# Altium schematic sheet microInv_batt_controller.SchDoc
size A3; SheetNumber: 1; SheetTotal: 1
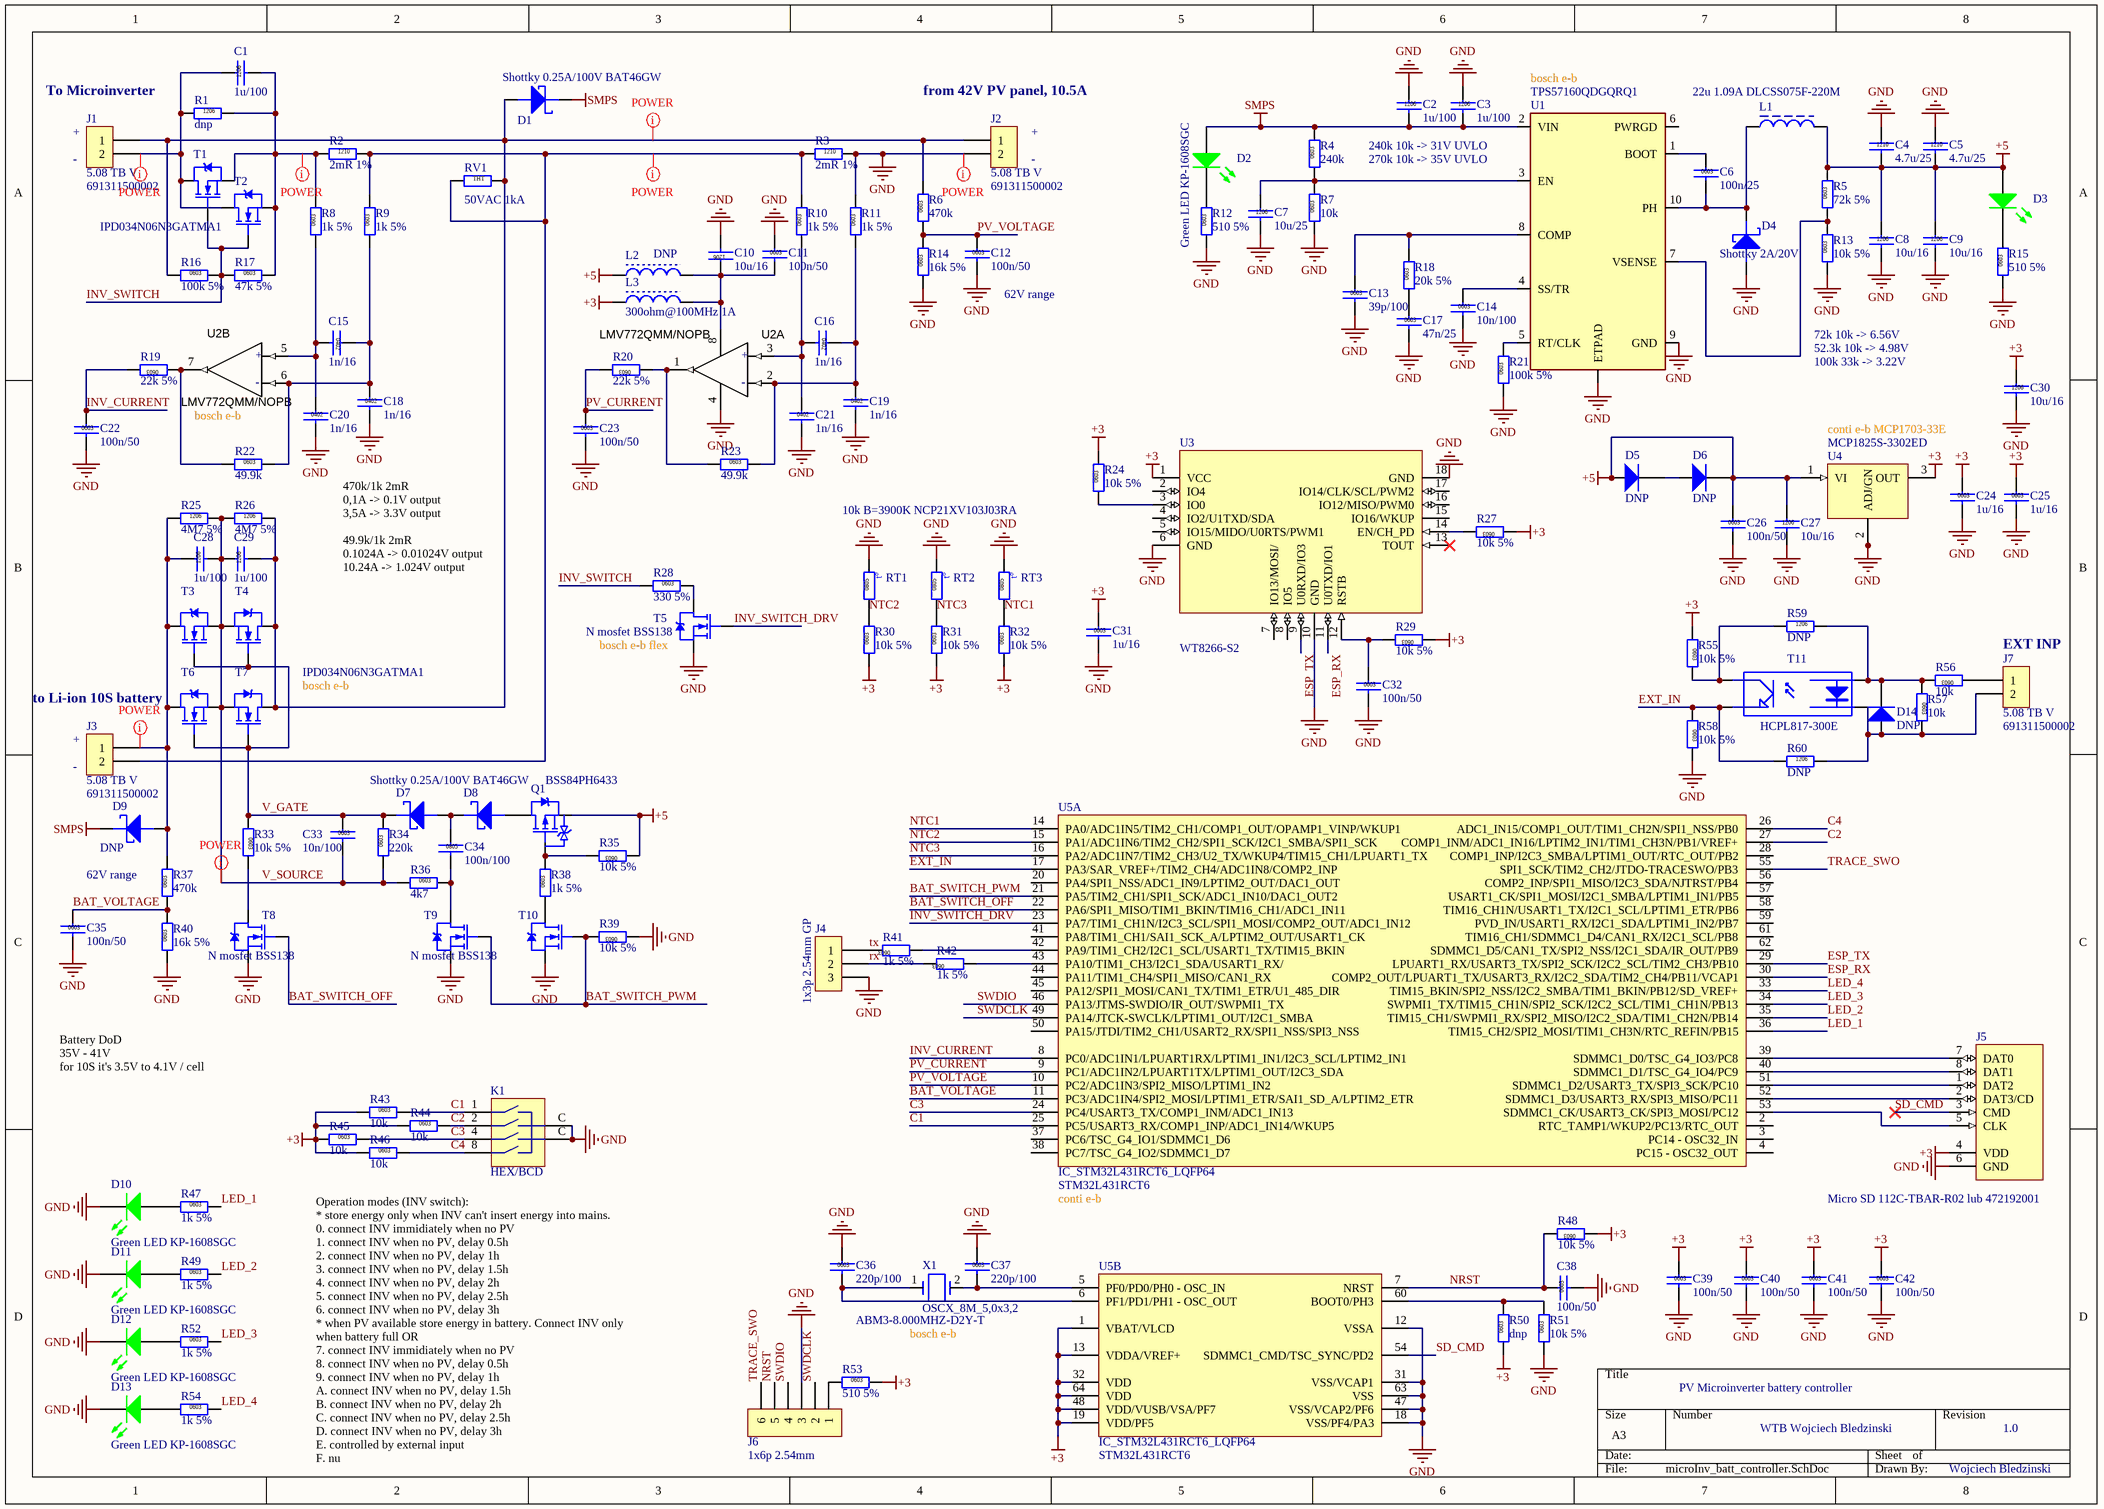
[diagram p0: microInv_batt_controller.SchDoc]

## Parts
C1  1u/100  [CAP_1206]
C2  1u/100  [CAP_1206]
C3  1u/100  [CAP_1206]
C4  4.7u/25  [CAP_1210]
C5  4.7u/25  [CAP_1210]
C6  100n/25  [CAP_0603]
C7  10u/25  [CAP_1206]
C8  10u/16  [CAP_1206]
C9  10u/16  [CAP_1206]
C10  10u/16  [CAP_1206]
C11  100n/50  [CAP_0603]
C12  100n/50  [CAP_0603]
C13  39p/100  [CAP_0603]
C14  10n/100  [CAP_0603]
C15  1n/16  [CAP_0402_HD_IPC]
C16  1n/16  [CAP_0402_HD_IPC]
C17  47n/25  [CAP_0603]
C18  1n/16  [CAP_0402_HD_IPC]
C19  1n/16  [CAP_0402_HD_IPC]
C20  1n/16  [CAP_0402_HD_IPC]
C21  1n/16  [CAP_0402_HD_IPC]
C22  100n/50  [CAP_0603]
C23  100n/50  [CAP_0603]
C24  1u/16  [CAP_0603]
C25  1u/16  [CAP_0603]
C26  100n/50  [CAP_0603]
C27  10u/16  [CAP_1206]
C28  1u/100  [CAP_1206]
C29  1u/100  [CAP_1206]
C30  10u/16  [CAP_1206]
C31  1u/16  [CAP_0603]
C32  100n/50  [CAP_0603]
C33  10n/100  [CAP_0603]
C34  100n/100  [CAP_0805]
C35  100n/50  [CAP_0603]
C36  220p/100  [CAP_0603]
C37  220p/100  [CAP_0603]
C38  100n/50  [CAP_0603]
C39  100n/50  [CAP_0603]
C40  100n/50  [CAP_0603]
C41  100n/50  [CAP_0603]
C42  100n/50  [CAP_0603]
D1  Shottky 0.25A/100V BAT46GW  [SOD_123]
D2  Green LED KP-1608SGC  [LED_0603_GREEN]
D3  Green LED KP-1608SGC  [LED_0603_GREEN]  (value not drawn)
D4  Shottky 2A/20V  [SMA_DO-214AC]
D5  DNP  [D_MINIMELF]
D6  DNP  [D_MINIMELF]
D7  Shottky 0.25A/100V BAT46GW  [SOD_123]
D8  Shottky 0.25A/100V BAT46GW  [SOD_123]  (value not drawn)
D9  DNP  [SOD_123]
D10  Green LED KP-1608SGC  [LED_0603_GREEN]
D11  Green LED KP-1608SGC  [LED_0603_GREEN]
D12  Green LED KP-1608SGC  [LED_0603_GREEN]
D13  Green LED KP-1608SGC  [LED_0603_GREEN]
D14  DNP  [D_MINIMELF]
J1  5.08 TB V  Manufacturer Part Number: 691311500002  [CON_1x2_5.08TB]
J2  5.08 TB V  Manufacturer Part Number: 691311500002  [CON_1x2_5.08TB]
J3  5.08 TB V  Manufacturer Part Number: 691311500002  [CON_1x2_5.08TB]
J4  1x3p 2.54mm GP  [CON_PIN1x3_THT]
J5  Micro SD 112C-TBAR-R02 lub 472192001  [112C_TXAR_R01]
J6  1x6p 2.54mm  [CON_PIN1x6_THT]
J7  5.08 TB V  Manufacturer Part Number: 691311500002  [CON_1x2_5.08TB]
K1  HEX/BCD  [MECH_SW_HEXBCD]
L1  22u 1.09A DLCSS075F-220M  [IND_DER0705]
L2  DNP  [RES_0603]
L3  300ohm@100MHz 1A  [RES_0603]
Q1  BSS84PH6433  [SOT23-3]
R1  dnp  [RES_1206]
R2  2mR 1%  [RES_1210]
R3  2mR 1%  [RES_1210]
R4  240k  [RES_0603]
R5  72k 5%  [RES_0603]
R6  470k  [RES_0603]
R7  10k  [RES_0603]
R8  1k 5%  [RES_0603]
R9  1k 5%  [RES_0603]
R10  1k 5%  [RES_0603]
R11  1k 5%  [RES_0603]
R12  510 5%  [RES_0603]
R13  10k 5%  [RES_0603]
R14  16k 5%  [RES_0603]
R15  510 5%  [RES_0603]
R16  100k 5%  [RES_0603]
R17  47k 5%  [RES_0603]
R18  20k 5%  [RES_0603]
R19  22k 5%  [RES_0603]
R20  22k 5%  [RES_0603]
R21  100k 5%  [RES_0603]
R22  49.9k  [RES_0603]
R23  49.9k  [RES_0603]
R24  10k 5%  [RES_0603]
R25  4M7 5%  [RES_1206]
R26  4M7 5%  [RES_1206]
R27  10k 5%  [RES_0603]
R28  330 5%  [RES_0603]
R29  10k 5%  [RES_0603]
R30  10k 5%  [RES_0603]
R31  10k 5%  [RES_0603]
R32  10k 5%  [RES_0603]
R33  10k 5%  [RES_0603]
R34  220k  [RES_0603]
R35  10k 5%  [RES_0603]
R36  4k7  [RES_0603]
R37  470k  [RES_0603]
R38  1k 5%  [RES_0603]
R39  10k 5%  [RES_0603]
R40  16k 5%  [RES_0603]
R41  1k 5%  [RES_0603]
R42  1k 5%  [RES_0603]
R43  10k  [RES_0603]
R44  10k  [RES_0603]
R45  10k  [RES_0603]
R46  10k  [RES_0603]
R47  1k 5%  [RES_0603]
R48  10k 5%  [RES_0603]
R49  1k 5%  [RES_0603]
R50  dnp  [RES_0603]
R51  10k 5%  [RES_0603]
R52  1k 5%  [RES_0603]
R53  510 5%  [RES_0603]
R54  1k 5%  [RES_0603]
R55  10k 5%  [RES_0603]
R56  10k  [RES_0603]
R57  10k  [RES_0603]
R58  10k 5%  [RES_0603]
R59  DNP  [RES_1206]
R60  DNP  [RES_1206]
RT1  10k B=3900K NCP21XV103J03RA  [RES_0805]  (value not drawn)
RT2  10k B=3900K NCP21XV103J03RA  [RES_0805]  (value not drawn)
RT3  10k B=3900K NCP21XV103J03RA  [RES_0805]
RV1  50VAC 1kA  [RES_VAR_S14]
T1  IPD034N06N3GATMA1  [DPAK_369C_issueD]
T2  IPD034N06N3GATMA1  [DPAK_369C_issueD]  (value not drawn)
T3  IPD034N06N3GATMA1  [DPAK_369C_issueD]  (value not drawn)
T4  IPD034N06N3GATMA1  [DPAK_369C_issueD]  (value not drawn)
T5  N mosfet BSS138  [SOT23-3]
T6  IPD034N06N3GATMA1  [DPAK_369C_issueD]  (value not drawn)
T7  IPD034N06N3GATMA1  [DPAK_369C_issueD]
T8  N mosfet BSS138  [SOT23-3]
T9  N mosfet BSS138  [SOT23-3]
T10  N mosfet BSS138  [SOT23-3]  (value not drawn)
T11  HCPL817-300E  [HCPL-817]
U1  TPS57160QDGQRQ1  [MSOP10_DQG_S_PDSO_G10]
U2  LMV772QMM/NOPB  [MSOP8_3x3_846AD-01]  (parts A,B of 2)
U3  WT8266-S2  [MOD_WT8266-S2]
U4  MCP1825S-3302ED  [sot223]
U5  IC_STM32L431RCT6_LQFP64  Manufacturer Part Number: STM32L431RCT6  [LQFP64_10x10]  (parts A,B of 2)
X1  OSCX_8M_5,0x3,2  Manufacturer Part Number: ABM3-8.000MHZ-D2Y-T  [X_5.0X3.2]

## Nets
+3: C24.1 C25.1 C30.1 C31.1 C39.1 C40.1 C41.1 C42.1 J5.4(VDD) L3.1 R24.2 R27.1 R29.1 R30.1 R31.1 R32.1 R43.1 R44.1 R45.1 R46.1 R48.1 R50.1 R53.2 R55.1 U3.1(VCC) U4.3(OUT) U5.1(VBAT/VLCD) U5.13(VDDA/VREF+) U5.19(VDD/PF5) U5.32(VDD) U5.48(VDD/VUSB/VSA/PF7) U5.64(VDD)
+5: C4.2 C5.2 C8.1 C9.1 C26.1 C27.1 D3.1(A) D5.1(A) D6.2(K) L1.2 L2.1 Q1.2(S) R5.2 R35.1 U4.1(VI)
GND: C2.1 C3.1 C4.1 C5.1 C7.2 C8.2 C9.2 C10.2 C11.1 C12.2 C13.2 C14.2 C17.2 C18.2 C19.2 C20.2 C21.2 C22.2 C23.2 C24.2 C25.2 C26.2 C27.2 C30.2 C31.2 C32.2 C35.2 C36.1 C37.1 C38.2 C39.2 C40.2 C41.2 C42.2 D4.1(A) D10.2(K) D11.2(K) D12.2(K) D13.2(K) J2.2 J4.3 J5.6(GND) J6.3 K1.C R3.2 R7.1 R11.2 R12.1 R13.1 R14.1 R15.1 R21.1 R39.1 R40.1 R51.1 R58.2 RT1.2 RT2.2 RT3.2 T5.2(S) T8.2(S) T9.2(S) T10.2(S) U1.9(GND) U1.11(ETPAD) U2.4(-V) U3.6(GND) U3.10(GND) U3.18(GND) U4.2(ADJ/GN) U4.4 U5.12(VSSA) U5.18(VSS/PF4/PA3) U5.31(VSS/VCAP1) U5.47(VSS/VCAP2/PF6) U5.63(VSS)
SMPS: C2.2 C3.2 D1.2(K) D2.1(A) D9.2(K) R4.2 U1.2(VIN)
BAT_SWITCH_OFF: T8.1(G) U5.22(PA6/SPI1_MISO/TIM1_BKIN/TIM16_CH1/ADC1_IN11)
BAT_SWITCH_PWM: R39.2 T9.1(G) T10.1(G) U5.21(PA5/TIM2_CH1/SPI1_SCK/ADC1_IN10/DAC1_OUT2)
BAT_VOLTAGE: C35.1 R37.1 R40.2 U5.11(PC3/ADC1IN4/SPI2_MOSI/LPTIM1_ETR/SAI1_SD_A/LPTIM2_ETR)
C1: K1.1 R43.2 U5.25(PC5/USART3_RX/COMP1_INP/ADC1_IN14/WKUP5)
C2: K1.2 R44.2 U5.27(COMP1_INM/ADC1_IN16/LPTIM2_IN1/TIM1_CH3N/PB1/VREF+)
C3: K1.4 R45.2 U5.24(PC4/USART3_TX/COMP1_INM/ADC1_IN13)
C4: K1.8 R46.2 U5.26(ADC1_IN15/COMP1_OUT/TIM1_CH2N/SPI1_NSS/PB0)
ESP_RX: U3.11(U0TXD/IO1) U5.30(COMP2_OUT/LPUART1_TX/USART3_RX/I2C2_SDA/TIM2_CH4/PB11/VCAP1)
ESP_TX: U3.9(U0RXD/IO3) U5.29(LPUART1_RX/USART3_TX/SPI2_SCK/I2C2_SCL/TIM2_CH3/PB10)
EXT_IN: R58.1 R60.1 T11.3(E) U5.17(PA3/SAR_VREF+/TIM2_CH4/ADC1IN8/COMP2_INP)
INV_CURRENT: C22.1 R19.2 U5.8(PC0/ADC1IN1/LPUART1RX/LPTIM1_IN1/I2C3_SCL/LPTIM2_IN1)
INV_SWITCH: R16.2 R17.1 R28.1 T1.1(G) T2.1(G)
INV_SWITCH_DRV: T5.1(G) U5.23(PA7/TIM1_CH1N/I2C3_SCL/SPI1_MOSI/COMP2_OUT/ADC1_IN12)
LED_1: R47.2 U5.36(TIM15_CH2/SPI2_MOSI/TIM1_CH3N/RTC_REFIN/PB15)
LED_2: R49.2 U5.35(TIM15_CH1/SWPMI1_RX/SPI2_MISO/I2C2_SDA/TIM1_CH2N/PB14)
LED_3: R52.2 U5.34(SWPMI1_TX/TIM15_CH1N/SPI2_SCK/I2C2_SCL/TIM1_CH1N/PB13)
LED_4: R54.2 U5.33(TIM15_BKIN/SPI2_NSS/I2C2_SMBA/TIM1_BKIN/PB12/SD_VREF+)
NRST: C38.1 J6.5 R48.2 U5.7(NRST)
NTC1: R32.2 RT3.1 U5.14(PA0/ADC1IN5/TIM2_CH1/COMP1_OUT/OPAMP1_VINP/WKUP1)
NTC2: R30.2 RT1.1 U5.15(PA1/ADC1IN6/TIM2_CH2/SPI1_SCK/I2C1_SMBA/SPI1_SCK)
NTC3: R31.2 RT2.1 U5.16(PA2/ADC1IN7/TIM2_CH3/U2_TX/WKUP4/TIM15_CH1/LPUART1_TX)
PV_CURRENT: C23.1 R20.2 U5.9(PC1/ADC1IN2/LPUART1TX/LPTIM1_OUT/I2C3_SDA)
PV_VOLTAGE: C12.1 R6.1 R14.2 U5.10(PC2/ADC1IN3/SPI2_MISO/LPTIM1_IN2)
rx: J4.2 R42.1
SD_CMD: J5.3(CMD) U5.54(SDMMC1_CMD/TSC_SYNC/PD2)
SWDCLK: J6.2 U5.49(PA14/JTCK-SWCLK/LPTIM1_OUT/I2C1_SMBA)
SWDIO: J6.4 U5.46(PA13/JTMS-SWDIO/IR_OUT/SWPMI1_TX)
TRACE_SWO: J6.6 U5.55(SPI1_SCK/TIM2_CH2/JTDO-TRACESWO/PB3)
tx: J4.1 R41.1
V_GATE: C33.1 D7.2(K) R33.1 R34.2 T3.1(G) T4.1(G) T6.1(G) T7.1(G)
V_SOURCE: C28.2 C29.1 C33.2 R25.2 R26.1 R34.1 R36.1 T3.3(S) T4.3(S) T6.3(S) T7.3(S)
NetC1_1: C1.1 J1.2 R1.1 T1.4(D) T2.4(D)
NetC1_2: C1.2 R1.2 R2.1 R8.2 R17.2 T1.3(S) T2.3(S)
NetC6_1: C6.1 U1.1(BOOT)
NetC6_2: C6.2 D4.2(K) L1.1 U1.10(PH)
NetC7_1: C7.1 R4.1 R7.2 U1.3(EN)
NetC10_1: C10.1 C11.2 L2.2 L3.2 U2.8(+V)
NetC13_1: C13.1 R18.2 U1.8(COMP)
NetC14_1: C14.1 U1.4(SS/TR)
NetC15_1: C15.1 C18.1 R9.1 R22.2 U2.6(-)
NetC15_2: C15.2 C20.1 R8.1 U2.5(+)
NetC16_1: C16.1 C19.1 R11.1 R23.2 U2.2(-)
NetC16_2: C16.2 C21.1 R10.1 U2.3(+)
NetC17_1: C17.1 R18.1
NetC28_1: C28.1 D9.1(A) J3.1 R25.1 R37.2 T3.4(D) T6.4(D)
NetC29_2: C29.2 D1.1(A) J1.1 J2.1 R6.2 R16.1 R26.2 RV1.2 T4.4(D) T7.4(D)
NetC32_1: C32.1 R29.2 U3.12(RSTB)
NetC34_1: C34.1 D7.1(A) D8.2(K)
NetC34_2: C34.2 R36.2 T9.3(D)
NetC36_2: C36.2 U5.6(PF1/PD1/PH1_-_OSC_OUT) X1.1
NetC37_2: C37.2 U5.5(PF0/PD0/PH0_-_OSC_IN) X1.2
NetD2_2: D2.2(K) R12.2
NetD3_2: D3.2(K) R15.2
NetD5_2: D5.2(K) D6.1(A)
NetD8_1: D8.1(A) Q1.3(D)
NetD10_1: D10.1(A) R47.1
NetD11_1: D11.1(A) R49.1
NetD12_1: D12.1(A) R52.1
NetD13_1: D13.1(A) R54.1
NetD14_1: D14.1(A) J7.2 R57.2 R60.2 T11.2(K)
NetD14_2: D14.2(K) R56.2 R57.1 R59.2 T11.1(A)
NetJ3_2: J3.2 R2.2 R3.1 R9.2 R10.2 RV1.1
NetJ5_1: J5.1(DAT2) U5.51(SDMMC1_D2/USART3_TX/SPI3_SCK/PC10)
NetJ5_2: J5.2(DAT3/CD) U5.52(SDMMC1_D3/USART3_RX/SPI3_MISO/PC11)
NetJ5_5: J5.5(CLK) U5.53(SDMMC1_CK/USART3_CK/SPI3_MOSI/PC12)
NetJ5_7: J5.7(DAT0) U5.39(SDMMC1_D0/TSC_G4_IO3/PC8)
NetJ5_8: J5.8(DAT1) U5.40(SDMMC1_D1/TSC_G4_IO4/PC9)
NetJ6_1: J6.1 R53.1
NetJ7_1: J7.1 R56.1
NetQ1_1: Q1.1(G) R35.2 R38.2
NetR5_1: R5.1 R13.2 U1.7(VSENSE)
NetR19_1: R19.1 R22.1 U2.7(O)
NetR20_1: R20.1 R23.1 U2.1(O)
NetR21_2: R21.2 U1.5(RT/CLK)
NetR24_1: R24.1 U3.3(IO0)
NetR27_2: R27.2 U3.14(EN/CH_PD)
NetR28_2: R28.2 T5.3(D)
NetR33_2: R33.2 T8.3(D)
NetR38_1: R38.1 T10.3(D)
NetR41_2: R41.2 U5.42(PA9/TIM1_CH2/I2C1_SCL/USART1_TX/TIM15_BKIN)
NetR42_2: R42.2 U5.43(PA10/TIM1_CH3/I2C1_SDA/USART1_RX/)
NetR50_2: R50.2 R51.2 U5.60(BOOT0/PH3)
NetR55_2: R55.2 R59.1 T11.4(C)

Not connected (* = marked no-connect by the designer): U1 6(PWRGD); U3 2(IO4) 4(IO2/U1TXD/SDA) 5(IO15/MIDO/U0RTS/PWM1) 7(IO13/MOSI/) 8(IO5) 13(TOUT)* 15(IO16/WKUP) 16(IO12/MISO/PWM0) 17(IO14/CLK/SCL/PWM2); U5 2(RTC_TAMP1/WKUP2/PC13/RTC_OUT) 3(PC14_-_OSC32_IN) 4(PC15_-_OSC32_OUT) 20(PA4/SPI1_NSS/ADC1_IN9/LPTIM2_OUT/DAC1_OUT) 28(COMP1_INP/I2C3_SMBA/LPTIM1_OUT/RTC_OUT/PB2) 37(PC6/TSC_G4_IO1/SDMMC1_D6) 38(PC7/TSC_G4_IO2/SDMMC1_D7) 41(PA8/TIM1_CH1/SAI1_SCK_A/LPTIM2_OUT/USART1_CK) 44(PA11/TIM1_CH4/SPI1_MISO/CAN1_RX) 45(PA12/SPI1_MOSI/CAN1_TX/TIM1_ETR/U1_485_DIR) 50(PA15/JTDI/TIM2_CH1/USART2_RX/SPI1_NSS/SPI3_NSS) 56(COMP2_INP/SPI1_MISO/I2C3_SDA/NJTRST/PB4) 57(USART1_CK/SPI1_MOSI/I2C1_SMBA/LPTIM1_IN1/PB5) 58(TIM16_CH1N/USART1_TX/I2C1_SCL/LPTIM1_ETR/PB6) 59(PVD_IN/USART1_RX/I2C1_SDA/LPTIM1_IN2/PB7) 61(TIM16_CH1/SDMMC1_D4/CAN1_RX/I2C1_SCL/PB8) 62(SDMMC1_D5/CAN1_TX/SPI2_NSS/I2C1_SDA/IR_OUT/PB9)

## Layout directives
net class POWER: GND, NetC1_1, NetC1_2, NetC28_1, NetC29_2, NetJ3_2, V_SOURCE

## Notes on the sheet
- To Microinverter
- (near J2) from 42V PV panel, 10.5A
- (near U1) bosch e-b
- (near J1) +
- (near J1) -
- (near J2) +
- (near J2) -
- 240k 10k -> 31V UVLO
- 270k 10k -> 35V UVLO
- (near C12) 62V range
- 52.3k 10k -> 4.98V
- 72k 10k -> 6.56V
- 100k 33k -> 3.22V
- bosch e-b
- conti e-b MCP1703-33E
- 470k/1k 2mR
  0,1A -> 0.1V output
  3,5A -> 3.3V output
  49.9k/1k 2mR
  0.1024A -> 0.01024V output
  10.24A -> 1.024V output
- (near T5) bosch e-b flex
- (near J7) EXT INP
- (near T6) to Li-ion 10S battery
- (near J3) +
- (near J3) -
- 62V range
- Battery DoD
  35V - 41V
  for 10S it's 3.5V to 4.1V / cell
- (near U5) conti e-b
- PV Microinverter battery controller
- Operation modes (INV switch):
  * store energy only when INV can't insert energy into mains.
  0. connect INV immidiately when no PV
  1. connect INV when no PV, delay 0.5h
  2. connect INV when no PV, delay 1h
  3. connect INV when no PV, delay 1.5h
  4. connect INV when no PV, delay 2h
  5. connect INV when no PV, delay 2.5h
  6. connect INV when no PV, delay 3h
  * when PV available store energy in battery. Connect INV only when battery full OR
  7. connect INV immidiately when no PV
  8. connect INV when no PV, delay 0.5h
  9. connect INV when no PV, delay 1h
  A. connect INV when no PV, delay 1.5h
  B. connect INV when no PV, delay 2h
  C. connect INV when no PV, delay 2.5h
  D. connect INV when no PV, delay 3h
  E. controlled by external input
  F. nu
- WTB Wojciech Bledzinski
- 1.0
- Wojciech Bledzinski
- (in symbol CAP_B_1n_16_0402_X7R) 0402
- (in symbol CAP_B_1u_16_0603_X7R) 0603
- (in symbol CAP_B_1u_100_1206_X7R) 1206
- (in symbol CAP_B_4.7u_25_1210_X5R) 1210
- (in symbol CAP_B_10n_100_0603_X7R) 0603
- (in symbol CAP_B_10u_16_1206_X7R) 1206
- (in symbol CAP_B_10u_25_1206_X5R) 1206
- (in symbol CAP_B_39p_100_0603_COG) 0603
- (in symbol CAP_B_47n_25_0603_X7R) 0603
- (in symbol CAP_B_100n_50_0603_X7R) 0603
- (in symbol CAP_B_100n_100_0805_X7R) 0805
- (in symbol CAP_B_220p_100_0603_COG) 0603
- (in symbol RES_0R_5p_1206) 1206
- (in symbol RES_1k_5p_0603) 0603
- (in symbol RES_2R2_5p_1210) 1210
- (in symbol RES_4M7_5p_1206) 1206
- (in symbol RES_10k_5p_0603) 0603
- (in symbol RES_16k_5p_0603) 0603
- (in symbol RES_20k_5p_0603) 0603
- (in symbol RES_22k_5p_0603) 0603
- (in symbol RES_47k_5p_0603) 0603
- (in symbol RES_62k_5p_0603) 0603
- (in symbol RES_100k_5p_0603) 0603
- (in symbol RES_105k_5p_0603) 0603
- (in symbol RES_330R_5p_0603) 0603
- (in symbol RES_510_5p_0603) 0603
- (in symbol REST_10k_5p_0805) t°; 0805

## Library data of the parts
C1-C3 C28 C29 = CAP_B_1u_100_1206_X7R: X7R chip capacitor; Manufacturer: AVX; Manufacturer Part Number: 12061C105KAT2A; Eng.: W.Bledzinski 12.06.2014; Tolerance: 10%; Type: SMD; Voltage: 100; Category: CAP; Price1k: 0.2; Price10: 0.22; Supplier: TME; Supplier Part Number: 12061C105KAT2A; Temperature: -55 to + 125 stC; Value: 1u/100; Supplier 1: FARNELL; Supplier Part Number 1: 2112837
C4 C5 = CAP_B_4.7u_25_1210_X5R: X5R chip capacitor; Manufacturer: YAGEO; Manufacturer Part Number: CC1210KKX5R8BB475; Eng.: W.Bledzinski 14.05.2014; Tolerance: 10%; Type: SMD; Voltage: 25; Category: CAP; Price1k: 0.007; Price10: 0.17; Supplier: TME; Supplier Part Number: CC1210KKX5R8475; Temperature: -55 to + 125 stC; Value: 4.7u/25; Supplier 1: Farnell; Supplier Part Number 1: 1833828
C6 C11 C12 C22 C23 C26 C32 C35 C38-C42 = CAP_B_100n_50_0603_X7R: X7R chip capacitor; Manufacturer: SAMSUNG; Manufacturer Part Number: CL10B104KB8NNNC; Eng.: W.Bledzinski 23.5.2013; Tolerance: 10%; Type: SMD; Voltage: 50; Category: CAP; Price1k: 0.006; Price10: 0.1; Supplier: TME; Supplier Part Number: CL10B104KB8NNNC; Temperature: -55 to + 125 stC
  C6: Value: 100n/25
  C11 C12 C22 C23 C26 C32 C35 C38-C42: Value: 100n/50
C7 = CAP_B_10u_25_1206_X5R: X5R chip capacitor; Manufacturer: SAMSUNG; Manufacturer Part Number: CL31A106KAHNNNE; Eng.: W.Bledzinski 23.10.2014; Tolerance: 10%; Type: SMD; Voltage: 25; Category: CAP; Price1k: 0.045; Price10: 0.08; Supplier: TME; Supplier Part Number: CL31A106KAHNNNE; Temperature: -55 to + 85 stC; Value: 10u/25; Supplier 1: Farnell; Supplier Part Number 1: 2426961
C8-C10 C27 C30 = CAP_B_10u_16_1206_X7R: X7R chip capacitor; Manufacturer: KYOCERA; Manufacturer Part Number: CM316X7R106K16AT; Eng.: W.Bledzinski 12.06.2014; Tolerance: 10%; Type: SMD; Voltage: 16; Category: CAP; Price1k: 0.045; Price10: 0.08; Supplier: TME; Supplier Part Number: CM316X7R106K16AT; Temperature: -55 to + 125 stC; Value: 10u/16; Supplier 1: Farnell; Supplier Part Number 1: 2070502
C13 = CAP_B_39p_100_0603_COG: COG chip capacitor; Eng.: W.Bledzinski 12.06.2015; Tolerance: 10%; Type: SMD; Voltage: 100; Category: CAP; Price1k: 0.006; Price10: 0.1; Supplier: TME; Temperature: -55 to + 125 stC; Value: 39p/100; Supplier 1: Farnell
C14 C33 = CAP_B_10n_100_0603_X7R: X7R chip capacitor; Manufacturer: SAMSUNG; Manufacturer Part Number: CL10B103KC8NNNC; Eng.: W.Bledzinski 08.05.2014; Tolerance: 10%; Type: SMD; Voltage: 100; Category: CAP; Price1k: 0.0027; Price10: 0.01; Supplier: TME; Supplier Part Number: CL10B103KC8NNNC; Temperature: -55 to + 125 stC; Value: 10n/100; Supplier 1: Farnell; Supplier Part Number 1: 1327671
C15 C16 C18-C21 = CAP_B_1n_16_0402_X7R: X7R chip capacitor; Manufacturer: SAMSUNG; Manufacturer Part Number: 0402YC102KAT2A; Eng.: W.Bledzinski 12.06.2014; Tolerance: 10%; Type: SMD; Voltage: 16; Category: CAP; Price1k: 0.0027; Price10: 0.01; Supplier: TME; Supplier Part Number: 0402YC102KAT2A; Temperature: -55 to + 125 stC; Value: 1n/16; Supplier 1: Farnell; Supplier Part Number 1: 1327660
C17 = CAP_B_47n_25_0603_X7R: X7R chip capacitor; Tolerance: 10%; Type: SMD; Voltage: 25; Category: CAP; Supplier: TME; Temperature: -55 to + 125 stC; Value: 47n/25; Supplier 1: Farnell
C24 C25 C31 = CAP_B_1u_16_0603_X7R: X7R chip capacitor; Manufacturer: SAMSUNG; Manufacturer Part Number: CL10B105KO8NNNC; Eng.: W.Bledzinski 23.5.2013; Tolerance: 10%; Type: SMD; Voltage: 16; Category: CAP; Price1k: 0.012; Price10: 0.1; Supplier: TME; Supplier Part Number: CL10B105KO8NNNC; Temperature: -55 to + 125 stC; Value: 1u/16; Supplier 1: Farnell; Supplier Part Number 1: 2310404
C34 = CAP_B_100n_100_0805_X7R: X7R chip capacitor; Manufacturer: AVX; Manufacturer Part Number: 08051C104KAZ2A; Eng.: W.Bledzinski 12.06.2014; Tolerance: 10%; Type: SMD; Voltage: 100; Category: CAP; Price1k: 0.03; Price10: 0.1; Supplier: TME; Supplier Part Number: 08051C104KAZ2A; Temperature: -55 to + 85 stC; Value: 100n/100; Supplier 1: FARNELL; Supplier Part Number 1: 1301805
C36 C37 = CAP_B_220p_100_0603_COG: COG chip capacitor; Manufacturer: SAMSUNG; Manufacturer Part Number: CL10C221JB8NNNC; Eng.: W.Bledzinski 14.05.2014; Tolerance: 5%; Type: SMD; Voltage: 100; Category: CAP; Price1k: 0.003; Price10: 0.01; Supplier: TME; Supplier Part Number: CL10C221JB8NNNC; Temperature: -55 to + 125 stC; Value: 220p/100; Supplier 1: Farnell; Supplier Part Number 1: 2320780
D1 D7 D8 = D_0.25_100_BAT46GWX: Shottky Diode trr 4ns 0,43V @ 0.05A 0.75V@0.25A; Manufacturer: Nexperia; Manufacturer Part Number: BAT46GWX 934070363115; Current: 250mA; Type: SMD; Voltage: 100; Category: DIODE; Price1k: 0.04; Price10: 0.062; Supplier: TME; Supplier Part Number: BAT46GWX; Temperature: -55 to +150 stC; Value: Shottky 0.25A/100V BAT46GW; Supplier 1: FARNELL; Supplier Part Number 1: 2760404
D2 D3 D10-D13 = D_LED_0603_GREEN: Diode LED SMD 2.2V @ 20mA 15mcd; Manufacturer: KINGBRIGHT; Eng.: W.Bledzinski 22.5.2013; Voltage: 5; Category: LED; Current: 20mA; Manufacturer Part Number: KP-1608SGC; Price1k: 0.03; Price10: 0.05; Supplier: TME; Supplier Part Number: KP-1608SGC; Temperature: -40 to +85 stC; Type: SMD; Value: Green LED KP-1608SGC; Supplier 1: Farnell; Supplier Part Number 1: 8529833
D4 = D_2A_20_B220A: Shottky Diode 0,5V @ 2A SMA 200pF; Manufacturer: DIODES; Manufacturer Part Number: B220A-13-F; Current: 2; Eng.: W.Bledzinski 4.6.2013; Type: SMD; Voltage: 20; Category: DIODE; Price1k: 0.06; Price10: 0.15; Supplier: AVNET; Supplier Part Number: B220-13-F; Temperature: -65 to + 150 stC; Value: Shottky 2A/20V; Supplier 1: FARNELL; Supplier Part Number 1: 1858604
D5 D6 D14 = D_LL4148_MMELF: Manufacturer: ON SEMICONDUCTOR (FAIRCHILD); Manufacturer Part Number: FDLL4148; Type: SMD; Max. off-state voltage: 100V; Max. forward impulse current: 2A; Max. load current: 0.5A; Load current: 0.15A; Forward voltage at If: 1.1V; Category: DIODE; Pricing: 50=0.0128, 250=0.0113, 1000=0.0092, 5000=0.0078, 20000=0.0074 (USD); Supplier 1: TME; Supplier Part Number 1: FDLL4148
D9 = D_0.25_100_BAT46GWX: Shottky Diode trr 4ns 0,43V @ 0.05A 0.75V@0.25A; Manufacturer: Nexperia; Manufacturer Part Number: BAT46GWX 934070363115; Current: 250mA; Type: SMD; Value: Shottky 0.25A/100V BAT46GW; Voltage: 100; Category: DIODE; Price1k: 0.04; Price10: 0.062; Supplier: TME; Supplier Part Number: BAT46GWX; Temperature: -55 to +150 stC; Supplier 1: FARNELL; Supplier Part Number 1: 2760404
J1-J3 J7 = CON_1x2_TB_5.08V: THT 5,08mm, WE 691311500002 (rev1), NINIGI , MLX; Manufacturer: Wurth Electronics; Pitch: 0.200" (5.08mm); Current: 20A; Supplier Unit Price 1: $0.33; Supplier 1: TME; Supplier 2: Digi-Key; Supplier Part Number 1: TBG-5-PB-2P/GN; Supplier Part Number 2: 732-2052-ND
J4 = CON_1x3_GP_THT: THT 2,54 goldpin; Manufacturer: TME; Manufacturer Part Number: ZL201-03G; Manufacturer2 Part Number: MX-90120-0123; Current: 3A; Eng.: W.Bledzinski 14.11.2013; Category: CONN; Price1k: 0.1; Price10: 0.15; Supplier: TME; Supplier Part Number: ZL201-03G; Temperature: -55 to +125 stC; Type: THT; Value: 1x3p 2.54mm GP; Manufacturer2: MOLEX; Supplier 1: digi-key; Supplier Part Number 1: WM8073-ND
J5 = CON_MicroSD: Micro SD connector SMD, ATTEND 112C-TBAR-R02; MOLEX 472192001; Eng.: W.Bledzinski 17.5.2013; Category: CONN; Manufacturer: ATTEND; Manufacturer Part Number: 112C-TBAR-R02; Price1k: 0.65; Price10: 0.8; Supplier: TME; Supplier Part Number: MCC-SDMICRO/1; Temperature: -25 to +85 stC; Type: SMD; Value: Micro SD 112C-TBAR-R02 lub 472192001; Supplier 1: TME; Supplier Part Number 1: MCC-SDMICRO/1
J6 = CON_1x6_GP_THT: THT 2,54 goldpin; Manufacturer: CONNFLY; Manufacturer Part Number: DS1021-1*6SF1-1; Manufacturer2 Part Number: ZL201-06G; Current: 3A; Eng.: W.Bledzinski 02.09.2013; Category: CONN; Price1k: 0.1; Price10: 0.15; Supplier: TME; Supplier Part Number: ZL201-06G; Temperature: -55 to +125 stC; Type: THT; Value: 1x6p 2.54mm; Manufacturer2: TME; Supplier 1: TME; Supplier Part Number 1: ZL201-06G
K1 = MECH_SW_HEXBCD: Zadajnik kodu; Manufacturer: ECE; Manufacturer Part Number: ERD116RSZ; Current: 100mA; Eng.: W.Bledzinski 22.04.2014; Voltage: 200V; Price1k: 1.8; Price10: 2.7; Supplier: TME; Supplier Part Number: ERD116RSZ; Temperature: -40 to + 85 stC; Type: THT; Value: HEX/BCD; Supplier 1: TME; Supplier Part Number 1: ERD116RSZ; Category: SWITCH
L1 = IND_22u_1.09A_DER0705-22: shielded power inductor 1.09A Rdc=0,12; Manufacturer: FERROCORE; Current: 1.09; Eng.: W.Bledzinski 16.06.2014; Tolerance: 20%; Type: SMD; Category: IND; Manufacturer Part Number: DER0705-22; Price1k: 0.4; Price10: 0.45; Supplier: MARITEX; Supplier Part Number: DLCSS075F-220M; Temperature: -40 to + 85 stC; Value: 22u 1.09A DLCSS075F-220M; Supplier 1: TME; Supplier Part Number 1: DER0705-22
L2 = IND_FB_300R_0603: 2A Rdc=0,15 SRF 250MHz; Manufacturer: WE; Manufacturer Part Number: 742792641; Current: 2; Eng.: W.Bledzinski 22.5.2013; Tolerance: 25%; Type: SMD; Value: 300ohm@100MHz 1A; Category: IND; Price1k: .08; Price10: .21; Supplier: FARNELL; Supplier Part Number: 1635705RL; Temperature: -40 to + 125 stC; Supplier 1: FARNELL; Supplier Part Number 1: 1635705
L3 = IND_FB_300R_0603: 2A Rdc=0,15 SRF 250MHz; Manufacturer: WE; Manufacturer Part Number: 742792641; Current: 2; Eng.: W.Bledzinski 22.5.2013; Tolerance: 25%; Type: SMD; Category: IND; Price1k: .08; Price10: .21; Supplier: FARNELL; Supplier Part Number: 1635705RL; Temperature: -40 to + 125 stC; Value: 300ohm@100MHz 1A; Supplier 1: FARNELL; Supplier Part Number 1: 1635705
Q1 = T_BSS84: 50V 130mA P Mosfet; Manufacturer: INFINEON TECHNOLOGIES; Drain-source voltage: -60V; Gate-source voltage: ±20V; Drain current: -140mA; On-state resistance: 8-12Ω @ 4.5V, 5-8Ω @ 10V; Power: 360mW; Vgs(th) (Max) @ Id: 2V @ 20µA; Rds On (Max) @ Id, Vgs: 8 Ohm @ 170mA, 10V; Input Capacitance (Ciss) (Max) @ Vds: 19pF @ 25V; Gate Charge (Qg) (Max) @ Vgs: 1.5nC @ 10V; Drive Voltage (Max Rds On,  Min Rds On): 4.5V, 10V; Pd - Power Dissipation: 300 mW; Supplier 1: TME; Manufacturer Part Number: BSS84PH6433; Pricing: 25=0.0345, 100=0.031, 500=0.0274, 2500=0.0246, 10000=0.023 (USD); Supplier Part Number 1: BSS84PH6433; Operating Temperature: -55°C ~ 150°C (TJ)
R1 R59 R60 = RES_0R_5p_1206: Resistor 1206 5% 0,25W; Manufacturer: ROYAL OHM; Manufacturer Part Number: 1206S4J0000T5E; Eng.: W.Bledzinski 03.06.2014; Value: 0R 5%; Voltage: 200; Current: 2A/4A; Category: RES; Price1k: 0.24; Price10: 0.3; Supplier: TME; Supplier Part Number: SMD1206-0R; Temperature: -55 to + 125 stC; Tolerance: 5%; Type: SMD; Supplier 1: Farnell; Supplier Part Number 1: 9336974
R2 R3 = RES_2R2_5p_1210: Resistor 1210 5% 0,5W; Voltage: 500; Category: RES; Price1k: 0.08; Price10: 0.14; Supplier: TME; Temperature: -55 to + 125 stC; Tolerance: 5%; Type: SMD; Value: 2mR 1%; Supplier 1: Farnell
R4 = RES_105k_5p_0603: Resistor 0603 5% 0,1W; Voltage: 50; Category: RES; Price1k: 0.003; Price10: 0.01; Supplier: TME; Temperature: -55 to + 125 stC; Tolerance: 5%; Type: SMD; Value: 240k; Supplier 1: TME
R5 = RES_62k_5p_0603: Resistor 0603 5% 0,1W; Manufacturer: YAGEO; Manufacturer Part Number: RC0603JR-0762K; Eng.: W.Bledzinski 14.05.2014; Voltage: 50; Category: RES; Price1k: 0.003; Price10: 0.01; Supplier: TME; Supplier Part Number: RC0603JR-0762KL; Temperature: -55 to + 125 stC; Tolerance: 5%; Type: SMD; Value: 72k 5%; Supplier 1: Farnell; Supplier Part Number 1: 2059649
R6 R8-R11 R22 R23 R37 R38 R41 R42 R47 R49 R52 R54 = RES_1k_5p_0603: Resistor 0603 5% 0,1W; Manufacturer: YAGEO; Eng.: W.Bledzinski 12.06.2015; Voltage: 50; Category: RES; Price1k: 0.003; Price10: 0.01; Supplier: TME; Temperature: -55 to + 125 stC; Tolerance: 5%; Type: SMD; Supplier 1: TME
  R6 R37: Value: 470k
  R8-R11 R38 R41 R42 R47 R49 R52 R54: Supplier Part Number: SMD0603-1K; Value: 1k 5%; Supplier Part Number 1: SMD0603-1K
  R22 R23: Value: 49.9k
R7 R14 R40 R43-R46 R56 R57 = RES_16k_5p_0603: Resistor 0603 5% 0,1W; Manufacturer: YAGEO; Voltage: 50; Category: RES; Price1k: 0.003; Price10: 0.01; Supplier: TME; Temperature: -55 to + 125 stC; Tolerance: 5%; Type: SMD; Supplier 1: TME
  R7 R43-R46 R56 R57: Value: 10k
  R14 R40: Value: 16k 5%
R12 R15 R53 = RES_510_5p_0603: Resistor 0603 5% 0,1W; Eng.: W.Bledzinski 23.06.2015; Voltage: 50; Category: RES; Price1k: 0.003; Price10: 0.01; Supplier: TME; Supplier Part Number: SMD0603-510R; Temperature: -55 to + 125 stC; Tolerance: 5%; Type: SMD; Value: 510 5%; Supplier 1: TME; Supplier Part Number 1: SMD0603-510R
R13 R24 R27 R29-R33 R35 R39 R48 R51 R55 R58 = RES_10k_5p_0603: Resistor 0603 5% 0,1W; Voltage: 50; Category: RES; Price1k: 0.003; Price10: 0.01; Tolerance: 5%; Type: SMD; Value: 10k 5%
R16 R34 R36 = RES_100k_5p_0603: Resistor 0603 5% 0,1W; Voltage: 50; Category: RES; Price1k: 0.003; Price10: 0.01; Supplier: TME; Temperature: -55 to + 125 stC; Tolerance: 5%; Type: SMD; Supplier 1: TME
  R16: Value: 100k 5%
  R34: Value: 220k
  R36: Value: 4k7
R17 = RES_47k_5p_0603: Resistor 0603 5% 0,1W; Manufacturer: YAGEO; Eng.: W.Bledzinski 12.06.2015; Voltage: 50; Category: RES; Price1k: 0.003; Price10: 0.01; Supplier: TME; Supplier Part Number: SMD0603-47K; Temperature: -55 to + 125 stC; Tolerance: 5%; Type: SMD; Value: 47k 5%; Supplier 1: TME; Supplier Part Number 1: SMD0603-47K
R18 = RES_20k_5p_0603: Resistor 0603 5% 0,1W; Manufacturer: ROYAL OHM; Manufacturer Part Number: 0603SAJ0203T5E; Eng.: W.Bledzinski 30.04.2014; Voltage: 50; Category: RES; Price1k: 0.003; Price10: 0.01; Supplier: TME; Supplier Part Number: SMD0603-20K; Temperature: -55 to + 125 stC; Tolerance: 5%; Type: SMD; Value: 20k 5%; Supplier 1: Farnell; Supplier Part Number 1: 1799402
R19 R20 = RES_22k_5p_0603: Resistor 0603 5% 0,1W; Manufacturer: YAGEO; Eng.: W.Bledzinski 12.06.2015; Voltage: 50; Category: RES; Price1k: 0.003; Price10: 0.01; Supplier: TME; Supplier Part Number: SMD0603-22K; Temperature: -55 to + 125 stC; Tolerance: 5%; Type: SMD; Value: 22k 5%; Supplier 1: TME; Supplier Part Number 1: SMD0603-22K
R21 = RES_100k_5p_0603: Resistor 0603 5% 0,1W; Eng.: W.Bledzinski 12.03.2016; Voltage: 50; Category: RES; Price1k: 0.003; Price10: 0.01; Supplier: TME; Temperature: -55 to + 125 stC; Tolerance: 5%; Type: SMD; Value: 100k 5%; Supplier 1: TME
R25 R26 = RES_4M7_5p_1206: Resistor 1206 5% 0,25W; Manufacturer: ROYAL OHM; Manufacturer Part Number: 1206S4J0475T5E; Eng.: W.Bledzinski 11.02.2014; Voltage: 200; Category: RES; Price1k: 0.004; Price10: 0.009; Supplier: TME; Supplier Part Number: SMD1206-4M7; Temperature: -55 to + 125 stC; Tolerance: 5%; Type: SMD; Value: 4M7 5%
R28 = RES_330R_5p_0603: Resistor 0603 5% 0,1W; Eng.: W.Bledzinski 10.12.2015; Voltage: 50; Category: RES; Price1k: 0.003; Price10: 0.01; Supplier: TME; Supplier Part Number: SMD0603-330R; Temperature: -55 to + 125 stC; Tolerance: 5%; Type: SMD; Value: 330 5%; Supplier 1: TME; Supplier Part Number 1: SMD0603-330R
R50 = RES_10k_5p_0603: Resistor 0603 5% 0,1W; Value: 10k 5%; Voltage: 50; Category: RES; Price1k: 0.003; Price10: 0.01; Tolerance: 5%; Type: SMD
RT1-RT3 = REST_10k_5p_0805: TERMISTOR, NTC, 0805 3900K, permissive current 0.4mA; Manufacturer: MURATA; Eng.: W.Bledzinski 01.04.2015; Tolerance: 5%; Category: RES; Manufacturer Part Number: NCP21XV103J03RA; Price1k: 0.074; Price10: 0.21; Supplier: TME; Supplier Part Number: NCP21XV103J03RA; Temperature: -40 to + 125 stC; Type: SMD; Value: 10k B=3900K NCP21XV103J03RA; Supplier 1: Farnell; Supplier Part Number 1: 2456126
RV1 = RESV_38V_1kA_THT: warystor S14 30VAC 38VDC 1kA 9J@2ms; Manufacturer: EPCOS; Eng.: W.Bledzinski 18.05.2015; Tolerance: 10%; Category: VAR; Price1k: 0.38; Price10: 0.83; Supplier: TME; Supplier Part Number: SIOV-S14K60; Temperature: -55 to + 125 stC; Type: THT; Value: 50VAC 1kA; Supplier 1: TME; Supplier Part Number 1: SIOV-S14K30
T1-T4 T6 T7 = T_IPD034N06N3: 60V N-Mosfet 100A 60V 3.54mohm; Manufacturer: INFINEON; Type: SMD; Rds On (Max) @ Id, Vgs: 3.4 mOhm @ 100A, 10V; Vgs (Max): ±20V; Vgs(th) (Max) @ Id: 4V @ 93µA; Drive Voltage (Max Rds On,  Min Rds On): 10V; Current - Continuous Drain (Id) @ 25°C: 100A (Tc); Category: TRANSISTOR; Manufacturer Part Number: IPD034N06N3GATMA1; Operating Temperature: -55°C ~ 175°C (TJ); Drain-source voltage: 60V; Supplier 2: Farnell; Pricing: 1=1.2696, 3=1.0935, 10=0.8782, 100=0.7623, 1000=0.7097 (USD); Supplier Part Number 1: IPD034N06N3GATMA1; Supplier Part Number 2: 2443392RL; Supplier: TME; Supplier 1: TME; Supplier Part Number: IPD034N06N3GATMA1
T5 T8-T10 = T_BSS138: 50V 0.3A N mosfet Rdson 6ohm @UGS=4.5V Qg=2.5nC; Manufacturer: FAIRCHILD; Eng.: W.Bledzinski 25.04.2014; Type: SMD; Category: TRANSISTOR; Current: 0.3A; Manufacturer Part Number: BSS138; Price1k: 0.04; Price10: 0.22; Supplier: TME; Supplier Part Number: BSS138; Temperature: -55 to + 150 stC; Value: N mosfet BSS138; Voltage: 50V; Supplier 1: Farnell; Supplier Part Number 1: 2323154
T11 = T_HCPL817-300E: HCPL817-300E / '0' ctr 50-600% / if 20ma ic 30ma vce 70V vr 4v; Manufacturer Part Number: HCPL-817-36BE; Type: SMD; Dark Current-Max: 100nA; Forward Current-Max: 50mA; Isolation Voltage-Max: 5kV; Forward Voltage-Max: 1.4V; On-State Current-Max: 30mA; Coll-emtr Bkdn Voltage-Min: 70V; Supplier 1: Farnell; Supplier Part Number 1: 1244566
U1 = IC_TPS57160QDGQRQ1: 116uA quescient current; Manufacturer: Texas Instruments; Voltage - Input (Max): 60V; Current - Output: 1.5A; Frequency - Switching: 100kHz ~ 2.5MHz; Supplier 1: Farnell; Supplier 2: Avnet; Pricing: 1=3.02, 10=2.716, 100=2.225, 500=1.89414, 1000=1.59747 (GBP); Supplier Part Number 1: 2492454; Supplier Part Number 2: TPS57160QDGQRQ1; Manufacturer Part Number: TPS57160QDGQRQ1; Operating Temperature: -40°C ~ 125°C (TA)
U2 = IC_LMV772QMM: LowOffset,LowNoise,RROOperationalAmplifier; Manufacturer: TI National Semiconductor; Max Supply Voltage: 5.5V; Min Supply Voltage: 2.7V; Gain Bandwidth Product: 3.5MHz; Operating Supply Current: 600uA; Manufacturer Part Number: LMV772QMM/NOPB; Min Operating Temperature: -40°C; Max Operating Temperature: 125°C; Supplier Part Number 1: 926-LMV772QMM/NOPB; Supplier 1: Mouser; Supplier Unit Price 1: $2.66
U3 = MOD_WT8266-S2: Manufacturer: xiaoe; Current: 215mA; Eng.: W.Bledzinski 29.09.2016; Voltage: 3.0 - 3.6; Category: MODULE; Manufacturer Part Number: WT8266-S2; Price1k: 6; Price10: 8; Supplier 1: TME; Supplier: maritex; Supplier Part Number 1: WT8266-S2; Supplier Part Number: WIFI-WT8266-S2; Temperature: -40 to +85 stC; Type: SMD; Value: WT8266-S2
U4 = IC_MCP1825S-3.3_SOT223: LDO=210mV 6V DC max, Iq 120uA, Cout 1u ceramic; Manufacturer: Microchip; Manufacturer Part Number: MCP1825S-3302E/DB; Current: 500mA; Category: IC; Price1k: 0.75; Price10: 1; Supplier: TME; Supplier Part Number: MCP1825S-3302ED; Type: SMD; Value: MCP1825S-3302ED; Voltage: 6V; Supplier 1: Farnell
U5 = IC_STM32L431RCT6_LQFP64: LQFP64, 10x10mm; Manufacturer: STMicroelectronics; Supplier Unit Price 1: $3.52; Case/Package: LQFP; Supplier 1: Arrow; Supplier 2: TME; Supplier Part Number 2: STM32L431RCT6; Supplier Part Number 1: STM32L431RCT6
X1 = OSCX_8M_5,0x3,2: SMD 5,0x3,2mm xtal drive 100uW max; ESR 150 ohm; Manufacturer: Abracon; Frequency Tolerance: 20ppm; Frequency Stability: 30ppm; Frequency: 8MHz; ESR (Equivalent Series Resistance): 500R; Category: OSC; Type: SMD; Max Operating Temperature: 85°C; Depth: 3.2mm; Composition: Ceramic; Min Operating Temperature: -40°C; Width: 3.2mm; Supplier Unit Price 1: $0.52632